# EAGLE design adder subtractor (EAGLE 7.2.0)
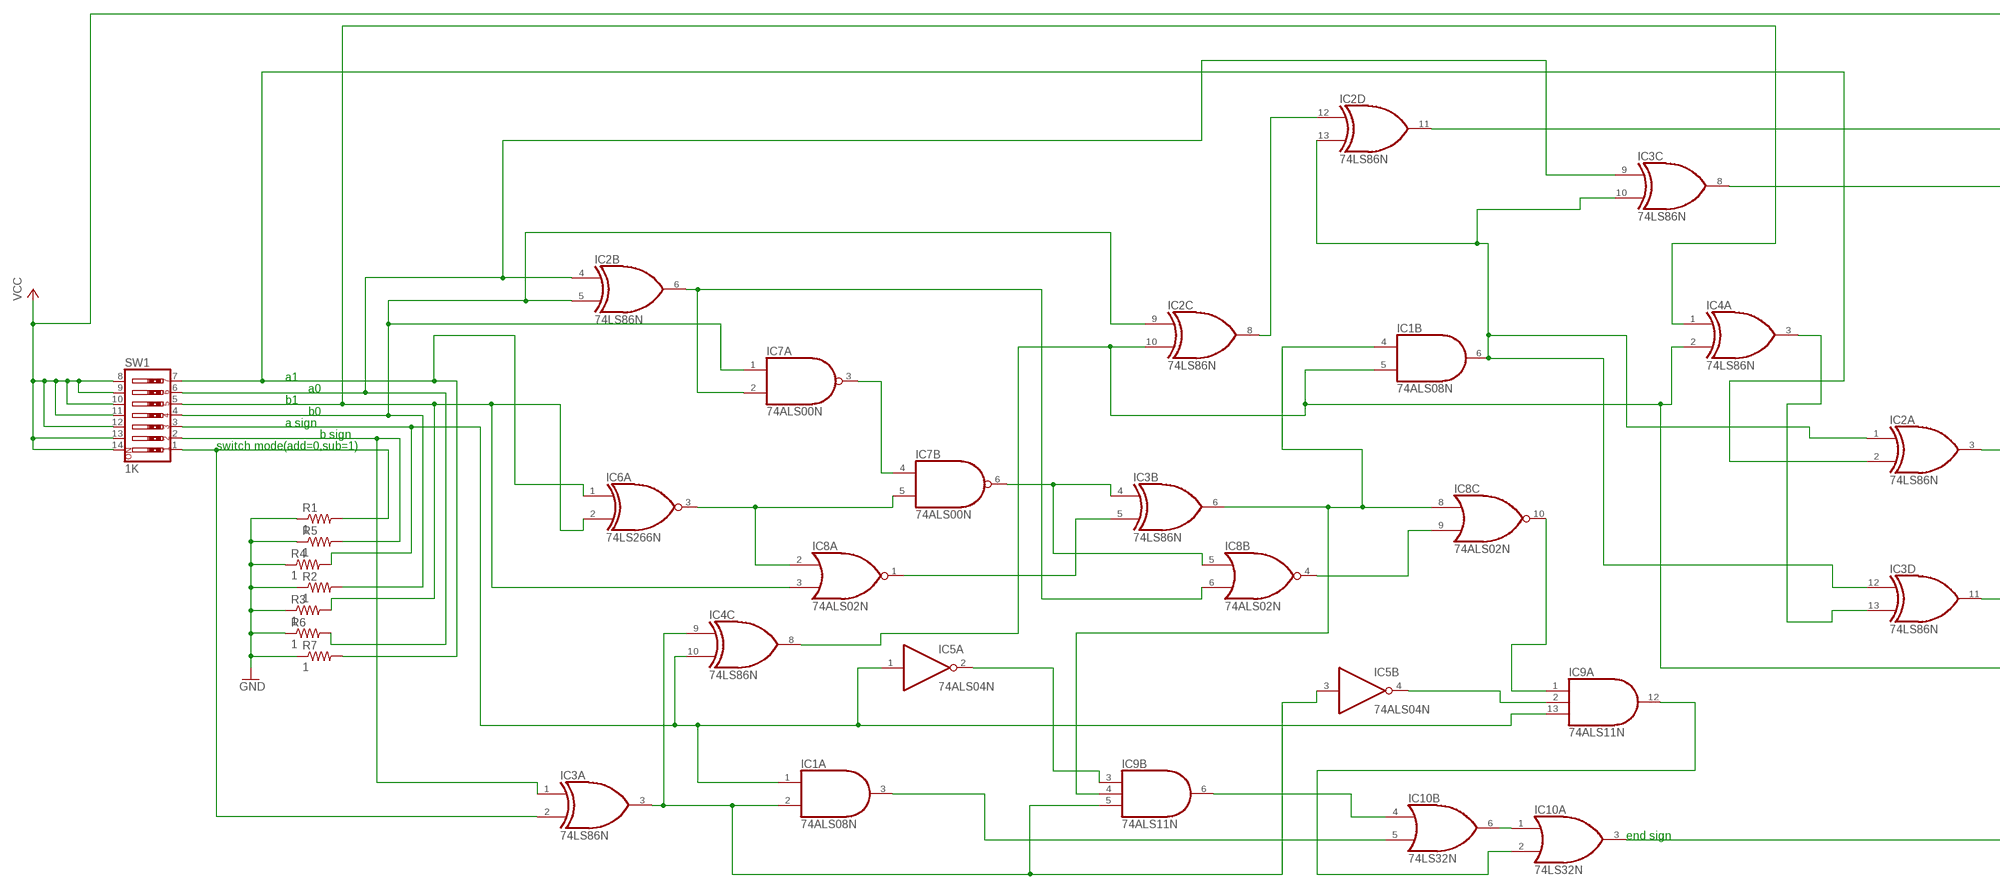
[diagram p0: schematic, sheet 1, part 1 of 2]
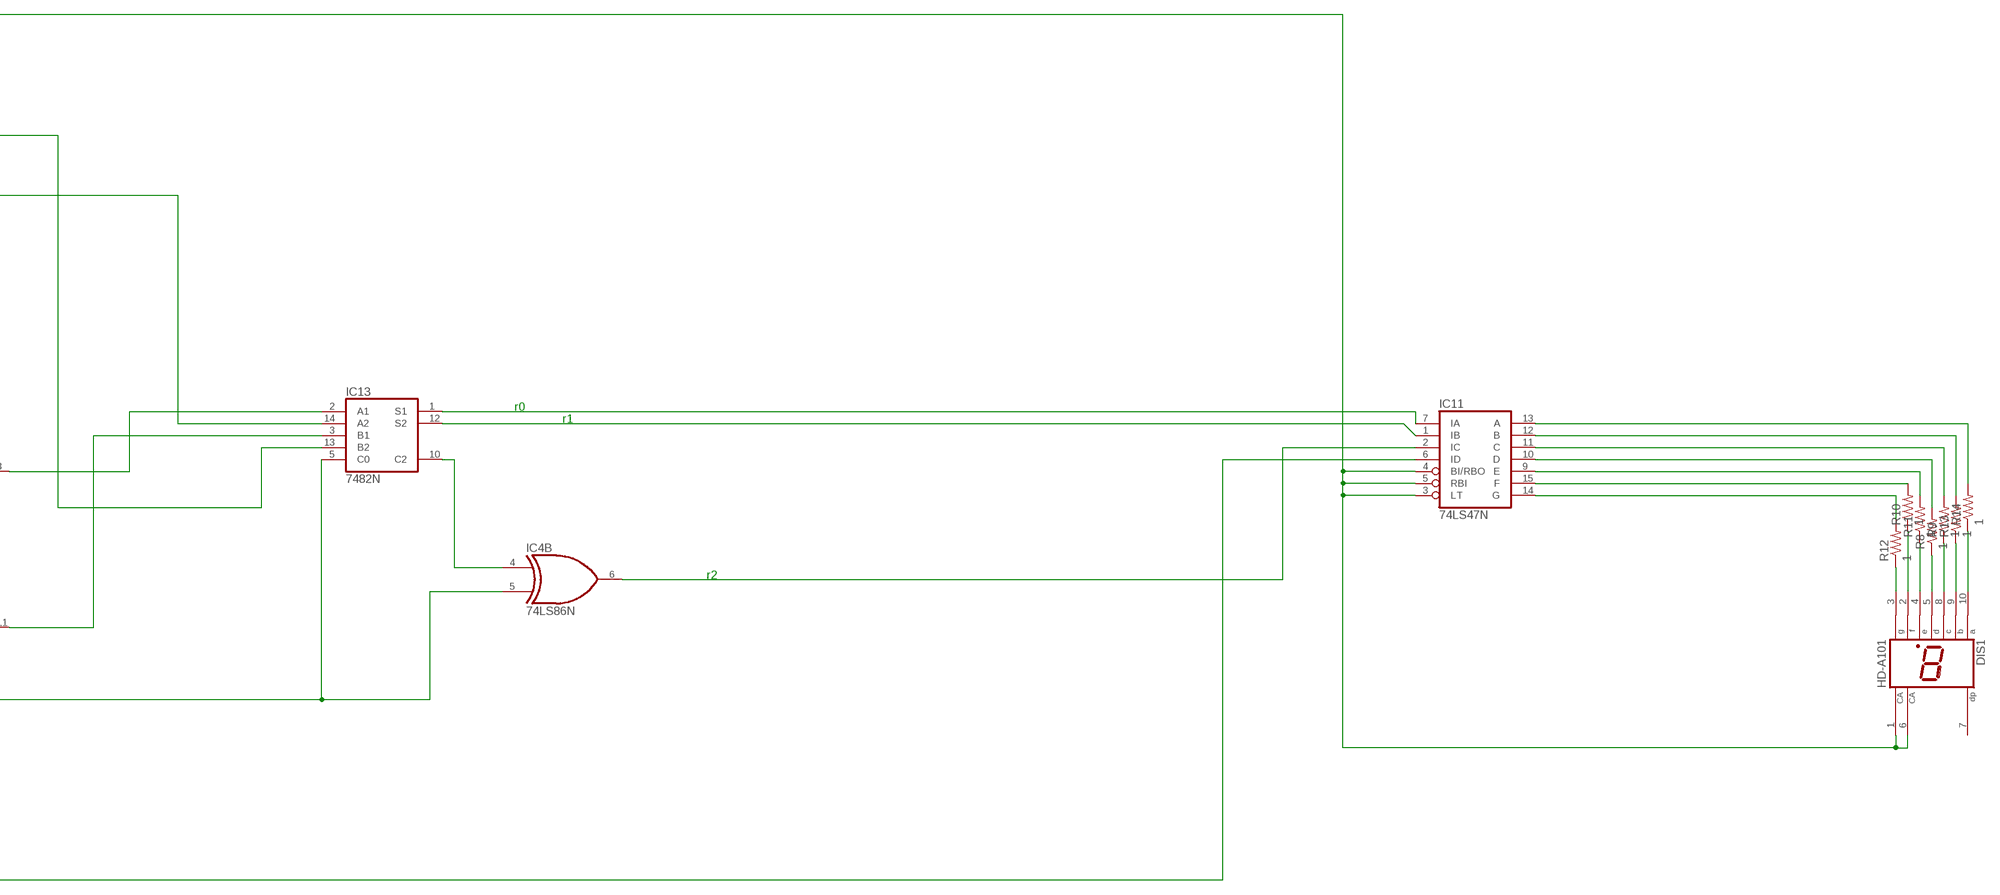
[diagram p1: schematic, sheet 1, part 2 of 2]

## Parts
DIS1  HD-A101  [HDSP-A]
IC1  74ALS08N  [DIL14]
IC2  74LS86N  [DIL14]
IC3  74LS86N  [DIL14]
IC4  74LS86N  [DIL14]
IC5  74ALS04N  [DIL14]
IC6  74LS266N  [DIL14]
IC7  74ALS00N  [DIL14]
IC8  74ALS02N  [DIL14]
IC9  74ALS11N  [DIL14]
IC10  74LS32N  [DIL14]
IC11  74LS47N  [DIL16]
IC13  7482N  [DIL14]
R1  1  R-US_0204/2V  [0204V]
R2  1  R-US_0204/2V  [0204V]
R3  1  R-US_0204/2V  [0204V]
R4  1  R-US_0204/2V  [0204V]
R5  1  R-US_0204/2V  [0204V]
R6  1  R-US_0204/2V  [0204V]
R7  1  R-US_0204/2V  [0204V]
R8  1  R-US_0204/2V  [0204V]
R9  1  R-US_0204/2V  [0204V]
R10  1  R-US_0204/2V  [0204V]
R11  1  R-US_0204/2V  [0204V]
R12  1  R-US_0204/2V  [0204V]
R13  1  R-US_0204/2V  [0204V]
R14  1  R-US_0204/2V  [0204V]
SW1  1K  SW_DIP-7  [EDG-07]

## Nets
GND: R1.1 R2.1 R3.1 R4.1 R5.1 R6.1 R7.1
N$1: IC2.2(A:I1) IC6.1(A:I0) R7.2 SW1.7
N$2: IC2.4(B:I0) IC3.9(C:I0) R6.2 SW1.6
N$3: IC4.1(A:I0) IC6.2(A:I1) IC8.3(A:I1) R3.2 SW1.5
N$4: IC2.5(B:I1) IC2.9(C:I0) IC7.1(A:I0) R2.2 SW1.4
N$5: IC1.1(A:I0) IC4.10(C:I1) IC5.1(A:I) IC9.13(A:I2) R4.2 SW1.3
N$6: IC3.1(A:I0) R5.2 SW1.2
N$7: IC2.11(D:O) IC13.13(B2)
N$9: IC2.6(B:O) IC7.2(A:I1) IC8.6(B:I1)
N$10: IC6.3(A:O) IC7.5(B:I1) IC8.2(A:I0)
N$11: IC7.3(A:O) IC7.4(B:I0)
N$12: IC3.4(B:I0) IC7.6(B:O) IC8.5(B:I0)
N$13: IC3.5(B:I1) IC8.1(A:O)
N$14: IC1.4(B:I0) IC3.6(B:O) IC8.8(C:I0) IC9.4(B:I1)
N$15: IC8.4(B:O) IC8.9(C:I1)
N$16: IC8.10(C:O) IC9.1(A:I0)
N$17: IC1.2(A:I1) IC3.3(A:O) IC4.9(C:I0) IC5.3(B:I) IC9.5(B:I2)
N$18: IC5.4(B:O) IC9.2(A:I1)
N$19: IC5.2(A:O) IC9.3(B:I0)
N$20: IC9.6(B:O) IC10.4(B:I0)
N$21: IC9.12(A:O) IC10.2(A:I1)
N$22: IC1.3(A:O) IC10.5(B:I1)
N$23: IC10.3(A:O) IC11.6(ID)
N$25: IC1.5(B:I1) IC2.10(C:I1) IC4.2(A:I1) IC4.5(B:I1) IC4.8(C:O) IC13.5(C0)
N$26: IC2.8(C:O) IC2.12(D:I0)
N$27: IC1.6(B:O) IC2.1(A:I0) IC2.13(D:I1) IC3.10(C:I1) IC3.12(D:I0)
N$28: IC3.13(D:I1) IC4.3(A:O)
N$29: IC2.3(A:O) IC13.2(A1)
N$30: IC3.8(C:O) IC13.14(A2)
N$31: IC3.11(D:O) IC13.3(B1)
N$33: IC11.7(IA) IC13.1(S1)
N$34: IC11.1(IB) IC13.12(S2)
N$35: IC4.4(B:I0) IC13.10(C2)
N$36: IC4.6(B:O) IC11.2(IC)
N$37: DIS1.10(A) R14.1
N$38: DIS1.9(B) R13.1
N$39: DIS1.8(C) R9.1
N$40: DIS1.5(D) R8.1
N$41: DIS1.4(E) R11.1
N$42: DIS1.2(F) R10.1
N$43: DIS1.3(G) R12.1
N$44: IC11.13(A) R14.2
N$45: IC11.12(B) R13.2
N$46: IC11.11(C) R9.2
N$47: IC11.10(D) R8.2
N$48: IC11.9(E) R11.2
N$49: IC11.15(F) R10.2
N$50: IC11.14(G) R12.2
N$51: IC3.2(A:I1) R1.2 SW1.1
N$55: IC10.1(A:I0) IC10.6(B:O)
VCC: DIS1.1(CA) DIS1.6(CA) IC11.3(LT) IC11.4(BI/RBO) IC11.5(RBI) SW1.8 SW1.9 SW1.10 SW1.11 SW1.12 SW1.13 SW1.14
Unconnected: DIS1.7(DP) IC1.8(C:O) IC1.9(C:I0) IC1.10(C:I1) IC1.11(D:O) IC1.12(D:I0) IC1.13(D:I1) IC4.11(D:O) IC4.12(D:I0) IC4.13(D:I1) IC5.5(C:I) IC5.6(C:O) IC5.8(D:O) IC5.9(D:I) IC5.10(E:O) IC5.11(E:I) IC5.12(F:O) IC5.13(F:I) IC6.4(B:O) IC6.5(B:I0) IC6.6(B:I1) IC6.8(C:I0) IC6.9(C:I1) IC6.10(C:O) IC6.11(D:O) IC6.12(D:I0) IC6.13(D:I1) IC7.8(C:O) IC7.9(C:I0) IC7.10(C:I1) IC7.11(D:O) IC7.12(D:I0) IC7.13(D:I1) IC8.11(D:I0) IC8.12(D:I1) IC8.13(D:O) IC9.8(C:O) IC9.9(C:I0) IC9.10(C:I1) IC9.11(C:I2) IC10.8(C:O) IC10.9(C:I0) IC10.10(C:I1) IC10.11(D:O) IC10.12(D:I0) IC10.13(D:I1)

## Notes on the sheet
- a1
- a0 | r0
- b1 | r1
- b0
- a sign
- b sign
- switch mode(add=0,sub=1)
- r2
- end sign

## Power pins joined to a net without a drawn wire
GND: IC1.7(P:GND) IC2.7(P:GND) IC3.7(P:GND) IC4.7(P:GND) IC5.7(P:GND) IC6.7(P:GND) IC7.7(P:GND) IC8.7(P:GND) IC9.7(P:GND) IC10.7(P:GND) IC11.8(GND) IC13.7(GND)
VCC: IC1.14(P:VCC) IC2.14(P:VCC) IC3.14(P:VCC) IC4.14(P:VCC) IC5.14(P:VCC) IC6.14(P:VCC) IC7.14(P:VCC) IC8.14(P:VCC) IC9.14(P:VCC) IC10.14(P:VCC) IC11.16(VCC) IC13.4(VCC)

## Library data of the parts
DIS1 = display-hp:HD-A101: LED DISPLAY 1-character 7 segment, decimal point right; OC_FARNELL: unknown; OC_NEWARK: unknown
IC1 = 74xx-us:74*08: Quad 2-input AND gate
IC2-IC4 = 74xx-us:74*86: Quad 2-input EXCLUSIV-OR (XOR) gate
IC5 = 74xx-us:74*04: Hex INVERTER
IC6 = 74xx-us:74*266: Quadruple EXCLUSIVE-NOR (XNOR), open-collector
IC7 = 74xx-us:74*00: Quad 2-input NAND gate
IC8 = 74xx-us:74*02: Quad 2-input NOR gate
IC9 = 74xx-us:74*11: Triple 3-input AND gate
IC10 = 74xx-us:74*32: Quad 2-input OR gate
IC11 = 74xx-us:74*47: BCD to seven segment DECODER/DRIVER Source: http://www.ee.washington.edu/stores/DataSheets/74ls/74ls47.pdf
IC13 = 74xx-us:74*82: 2-bit binary full ADDER
R1-R14 = rcl:R-US_: RESISTOR, American symbol
SW1 = special:SW_DIP-7: DIP SWITCH

## Board
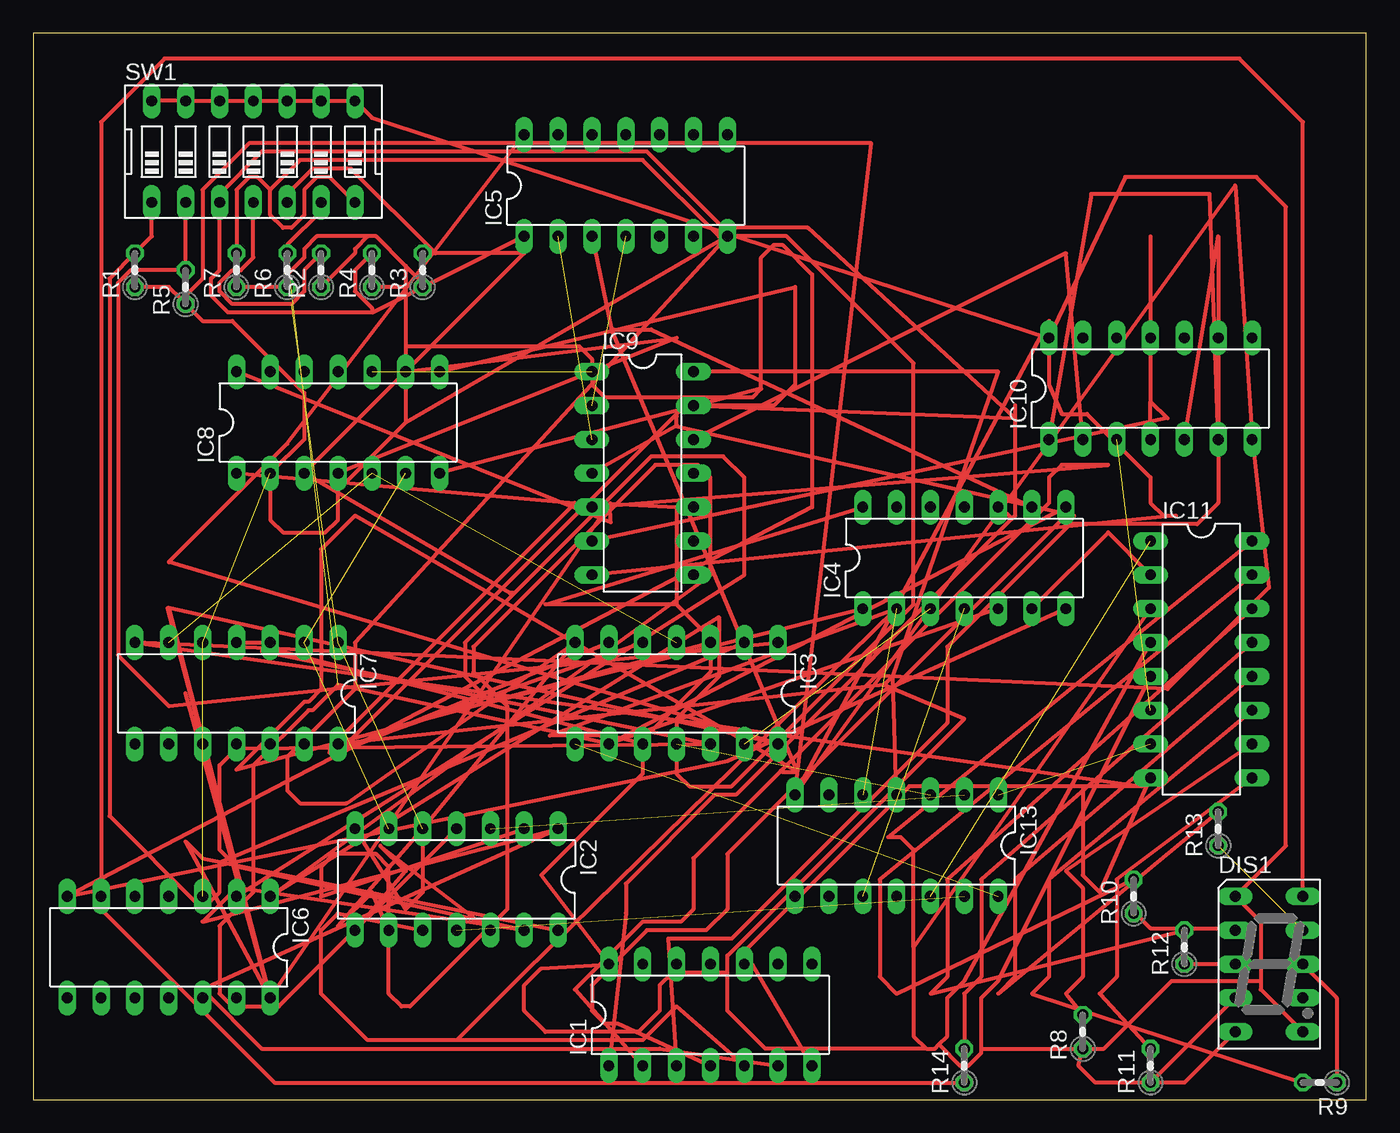
[diagram p2: board, top side]

Size 100 x 80 mm. Coordinates in mm from the lower left corner, seen from the top.
Outline: 0,0 100,0 100,80 0,80 0,0
Copper layers (1*16): Top 0.035mm / dielectric 1.5mm / Bottom 0.035mm
Design rules "default": minimum track width 10mil, minimum drill 24mil, track to track 8mil, track to pad 8mil, pad to pad 8mil, via to via 8mil, smd to smd 8mil, copper to edge 40mil, drill to drill 8mil, minimum pad ring 10mil, minimum via ring 8mil, stop-mask expansion 4mil, vias tented up to drill 0mil, thermal gap 10mil

### Footprints (pad centres in the part's own frame; a part is rotated, then mirrored left to right if it is on the bottom)
HDSP-A = drill 0.813 long: 1 -2.54,5.08; 2 -2.54,2.54; 3 -2.54,0; 4 -2.54,-2.54; 5 -2.54,-5.08; 6 2.54,-5.08; 7 2.54,-2.54; 8 2.54,0; 9 2.54,2.54; 10 2.54,5.08
DIL14 = drill 0.813 long: 1 -7.62,-3.81; 2 -5.08,-3.81; 3 -2.54,-3.81; 4 0,-3.81; 5 2.54,-3.81; 6 5.08,-3.81; 7 7.62,-3.81; 8 7.62,3.81; 9 5.08,3.81; 10 2.54,3.81; 11 0,3.81; 12 -2.54,3.81; 13 -5.08,3.81; 14 -7.62,3.81
DIL16 = drill 0.813 long: 1 -8.89,-3.81; 2 -6.35,-3.81; 3 -3.81,-3.81; 4 -1.27,-3.81; 5 1.27,-3.81; 6 3.81,-3.81; 7 6.35,-3.81; 8 8.89,-3.81; 9 8.89,3.81; 10 6.35,3.81; 11 3.81,3.81; 12 1.27,3.81; 13 -1.27,3.81; 14 -3.81,3.81; 15 -6.35,3.81; 16 -8.89,3.81
0204V = drill 0.813 octagon: 1 -1.27,0; 2 1.27,0
EDG-07 = drill 0.813 long: 1 -7.62,-3.81; 2 -5.08,-3.81; 3 -2.54,-3.81; 4 0,-3.81; 5 2.54,-3.81; 6 5.08,-3.81; 7 7.62,-3.81; 8 7.62,3.81; 9 5.08,3.81; 10 2.54,3.81; 11 0,3.81; 12 -2.54,3.81; 13 -5.08,3.81; 14 -7.62,3.81

### Placement (x,y rotation side)
DIS1  92.71,10.16 0 top
IC1  50.8,6.35 0 top
IC2  31.75,16.51 180 top
IC3  48.26,30.48 180 top
IC4  69.85,40.64 0 top
IC5  44.45,68.58 0 top
IC6  10.16,11.43 180 top
IC7  15.24,30.48 180 top
IC8  22.86,50.8 0 top
IC9  45.72,46.99 270 top
IC10  83.82,53.34 0 top
IC11  87.63,33.02 270 top
IC13  64.77,19.05 180 top
R1  7.62,62.23 90 top
R2  21.59,62.23 90 top
R3  29.21,62.23 90 top
R4  25.4,62.23 90 top
R5  11.43,60.96 90 top
R6  19.05,62.23 90 top
R7  15.24,62.23 90 top
R8  78.74,5.08 90 top
R9  96.52,1.27 180 top
R10  82.55,15.24 90 top
R11  83.82,2.54 90 top
R12  86.36,11.43 90 top
R13  88.9,20.32 90 top
R14  69.85,2.54 90 top
SW1  16.51,71.12 0 top

### Tracks (layer width: path | path; a pad name or v marks a point on that pad's centre or on a via)
GND
  Top 0.305: IC4.7 52.07,25.4 IC6.7 58.42,44.45 58.42,61.91 56.2,64.14 55.56,64.14 54.61,63.18 54.61,53.34 | IC2.7 27.94,14.29 29.21,15.56 29.21,20.32 IC3.7 23.5,22.23 20,22.23 19.05,23.18 19.05,25.72 24.13,30.8 24.13,34.29 IC5.7 27.94,50.8 | R7.1 R6.1 19.05,61.91 20.32,63.18 20.32,63.82 21.27,64.77 25.08,64.77 | R2.1 24.13,63.5 24.13,63.82 25.08,64.77 | 25.08,64.77 25.72,64.77 27.94,62.55 | 27.94,62.55 29.21,61.28 R3.1 | 27.94,62.55 27.94,60.96 | 27.94,60.96 27.94,56.52 | 27.94,56.52 27.94,50.8 | 54.61,53.34 53.98,52.7 42.86,52.7 41.91,53.66 41.91,55.56 40.96,56.52 27.94,56.52 | 54.61,53.34 IC8.7 | 27.94,60.96 R4.1 | IC1.7 53.34,11.11 65.72,23.5 78.74,23.5 | 78.74,23.5 83.19,23.5 IC7.7 85.09,30.8 92.71,38.42 IC10.7 90.17,68.58 IC13.7 | IC11.8 80.01,15.56 78.74,16.83 78.74,23.5 | R1.1 10.16,60.96 11.11,60.01 | IC9.7 85.72,43.81 84.77,43.81 83.82,44.77 83.82,46.67 79.06,51.44 77.15,51.44 76.2,53.66 76.2,58.42 IC13.7 | 11.11,60.01 12.7,61.59 12.7,68.26 16.19,71.75 62.87,71.75 IC13.7 | 11.11,60.01 R5.1 12.7,58.42 14.92,58.42 20.32,53.02 20.32,49.53 17.78,46.99 17.78,43.5 18.73,42.55 21.91,42.55 22.86,43.5 22.86,45.72 27.94,50.8
N$1
  Top 0.305: R7.2 15.24,68.26 16.19,69.22 16.83,69.22 17.78,68.26 | 17.78,68.26 17.78,66.36 18.73,65.41 19.37,65.41 20.32,66.36 20.32,68.26 21.27,69.22 22.23,69.22 SW1.7 | IC2.2 21.59,15.24 21.59,17.46 22.54,18.41 25.72,18.41 26.67,17.46 26.67,7.94 27.62,6.99 28.26,6.99 35.56,14.29 35.56,29.53 33.02,32.07 33.02,33.97 46.67,47.62 49.85,47.62 50.8,46.67 50.8,39.37 IC6.1 51.44,36.2 51.44,31.75 48.26,28.57 48.26,24.45 49.21,23.5 52.39,23.5 66.04,37.15 66.04,55.24 56.52,64.77 51.44,64.77 45.72,70.48 20,70.48 17.78,68.26
N$2  (1 unrouted)
  Top 0.305: R6.2 19.05,64.14 21.59,66.67 SW1.6 | IC2.4 18.41,6.99 14.92,6.99 13.97,7.94 13.97,13.02 16.51,15.56 16.51,25.08 20.64,29.21 20.95,29.21 22.86,31.11 IC3.9
N$3
  Top 0.305: IC4.1 34.29,29.84 32.38,31.75 32.38,34.29 36.07,37.97 | 36.07,37.97 46.35,48.26 51.75,48.26 53.34,46.67 53.34,39.37 IC6.2 | 30.16,63.5 36.83,63.5 IC8.3 35.76,38 36.04,38 36.07,37.97 | 30.16,63.5 R3.2 | SW1.5 19.05,67.94 20.95,69.85 23.81,69.85 30.16,63.5
N$4  (2 unrouted)
  Top 0.305: IC2.5 22.86,13.02 25.4,15.56 IC2.9 | SW1.4 16.51,63.18 15.56,62.23 14.92,62.23 13.97,61.28 13.97,60.64 14.92,59.69 19.37,59.69 20.32,60.64 20.32,62.23 R2.2
N$5
  Top 0.305: 25.4,59.05 25.4,59.37 24.13,60.64 24.13,62.23 R4.2 | 25.4,59.05 IC5.1 | 25.4,59.05 14.61,59.05 13.34,60.33 13.34,61.59 13.97,62.23 SW1.3 13.97,67.94 17.14,71.12 46.04,71.12 51.75,65.41 58.1,65.41 73.66,51.12 | IC1.1 44.45,13.97 44.45,16.19 51.12,22.86 52.7,22.86 73.42,43.58 | 73.42,43.58 73.66,43.81 73.66,51.12 | 73.66,52.07 73.66,51.12 | IC9.13 73.66,51.12 | IC4.10 72.55,44.45 73.42,43.58
N$6
  Top 0.305: IC3.1 10.16,29.53 6.35,33.34 6.35,61.28 7.3,62.23 R5.2 SW1.2
N$7  (1 unrouted)
N$9  (2 unrouted)
N$10  (2 unrouted)
N$11
  Top 0.305: IC7.4 IC7.3
N$12  (2 unrouted)
N$13
  Top 0.305: IC3.5 22.23,26.04 22.23,26.35 40.64,44.77 IC8.1
N$14
  Top 0.305: IC1.4 43.81,5.71 42.86,5.71 41.91,6.67 41.91,8.57 46.04,12.7 50.48,12.7 52.07,14.29 52.07,18.41 77.47,43.81 78.11,43.81 48.23,50.52 | IC9.4 48.23,50.52 | IC3.6 22.86,26.04 48.18,51.36 | 48.18,51.36 48.9,52.07 55.56,52.07 57.15,53.66 57.15,60.96 IC8.8 | 48.18,51.36 48.26,51.28 48.26,50.64 48.23,50.52
N$15
  Top 0.305: IC8.4 48.26,57.15 IC8.9
N$16  (1 unrouted)
N$17
  Top 0.305: IC1.2 40.64,8.26 45.72,13.34 48.58,13.34 49.53,14.29 49.53,18.1 56.09,24.66 | 56.09,24.66 76.2,44.77 76.2,46.67 77.15,47.62 80.64,47.62 IC9.5 | IC3.3 15.24,24.77 20.32,29.84 20.64,29.84 21.59,30.8 21.59,41.27 24.13,43.81 57.3,24.64 | IC5.3 43.39,57.74 | 43.39,57.74 57.3,24.64 | 57.3,24.64 57.28,24.59 56.16,24.59 56.09,24.66 | IC4.9 46.35,57.78 43.5,57.78 43.39,57.74
N$18  (1 unrouted)
N$19  (1 unrouted)
N$20
  Top 0.305: IC9.6 85.09,51.12 83.82,52.39 | 83.82,64.77 83.82,52.39 | IC10.4 83.82,52.39
N$21
  Top 0.305: IC9.12 77.47,63.5 IC10.2
N$22
  Top 0.305: IC1.3 47.62,12.06 52.39,12.06 68.58,28.26 68.58,33.97 77.79,43.18 87.31,43.18 88.9,44.77 88.9,64.77 IC10.5
N$23  (1 unrouted)
N$25  (1 unrouted)
  Top 0.305: IC4.5 43.18,26.67 | 43.18,26.67 42.55,27.3 38.73,27.3 IC4.2 36.83,9.53 31.75,4.45 | 43.18,26.67 IC4.8 | IC2.10 22.86,13.97 21.59,12.7 21.59,7.94 25.08,4.45 31.75,4.45 | 31.75,4.45 45.72,4.45 48.26,6.99 IC1.5
N$26
  Top 0.305: IC2.12 26.04,19.05 27.94,17.14 IC2.8
N$27
  Top 0.305: IC3.10 18.41,33.66 17.14,33.66 IC3.12 15.24,26.35 13.97,25.08 13.97,18.73 15.24,17.46 IC2.13 15.24,15.88 12.7,13.34 IC2.1 12.7,8.26 17.14,3.81 46.99,3.81 IC1.6
N$28  (1 unrouted)
N$29  (1 unrouted)
N$30  (1 unrouted)
N$31  (1 unrouted)
N$33  (1 unrouted)
N$34  (1 unrouted)
N$35  (1 unrouted)
N$36
  Top 0.305: IC4.6 80.64,42.55 IC11.2
N$37
  Top 0.305: R14.1 18.1,1.27 5.08,14.29 5.08,73.34 9.84,78.11 90.49,78.11 95.25,73.34 DIS1.10
N$38  (1 unrouted)
N$39
  Top 0.305: R9.1 97.79,7.62 DIS1.8
N$40
  Top 0.305: R8.1 78.42,2.54 79.69,1.27 86.36,1.27 DIS1.5
N$41
  Top 0.305: DIS1.4 R11.1
N$42
  Top 0.305: DIS1.2 89.97,12.85 83.82,12.85 82.7,13.97 R10.1
N$43
  Top 0.305: DIS1.3 R12.1
N$44
  Top 0.305: R14.2 69.85,7.94 71.12,9.21 71.12,16.51 IC11.13
N$45
  Top 0.305: R13.2 72.39,7.94 73.66,9.21 73.66,16.51 IC11.12
N$46
  Top 0.305: R9.2 74.93,7.94 76.2,9.21 76.2,16.51 IC11.11
N$47
  Top 0.305: R8.2 77.47,7.94 78.74,9.21 78.74,15.88 77.47,17.14 IC11.10
N$48
  Top 0.305: R11.2 80.01,7.94 81.28,9.21 81.28,16.51 IC11.9
N$49
  Top 0.305: R10.2 64.77,7.94 63.5,9.21 63.5,16.51 IC11.15
N$50
  Top 0.305: R12.2 67.31,7.94 68.58,9.21 68.58,16.51 IC11.14
N$51
  Top 0.305: IC3.2 13.97,17.78 13.97,15.56 13.02,14.61 12.38,14.61 5.71,21.27 5.71,61.59 R1.2 8.89,64.77 SW1.1
N$55
  Top 0.305: IC10.1 79.38,67.94 88.27,67.94 IC10.6
VCC
  Top 0.305: IC2.14 12.7,18.1 11.43,19.37 IC6.14 | 10.15,36.9 IC3.14 10.16,40.32 19.05,49.21 IC5.14 | 10.15,36.9 IC6.14 | IC6.14 11.43,30.48 | SW1.14 SW1.13 SW1.12 SW1.11 SW1.10 SW1.9 SW1.8 25.4,73.66 IC10.14 81.92,69.22 91.76,69.22 93.98,66.99 93.98,19.05 DIS1.1 92.08,13.34 92.08,8.89 | 48.26,37.15 50.8,34.61 50.8,32.07 45.72,26.99 45.72,24.45 38.1,16.83 IC1.14 38.1,9.84 36.83,8.57 36.83,6.67 38.42,5.08 45.4,5.08 46.99,6.67 46.99,8.57 47.94,9.53 52.07,9.53 | 48.26,37.15 48.26,44.45 43.28,44.72 | IC6.14 43.28,44.72 | IC4.14 38.42,37.15 48.26,37.15 | DIS1.6 92.08,8.26 92.08,8.89 | IC11.16 64.14,19.68 65.09,19.68 66.04,18.73 66.04,11.43 | IC11.3 66.04,11.43 | IC11.4 69.85,8.89 68.58,7.62 68.58,4.76 67.94,4.13 | 67.94,4.13 67.63,3.81 66.99,3.81 | 66.99,3.81 66.04,4.76 66.04,11.43 | 63.81,31.09 69.85,28.57 52.07,10.79 52.07,9.53 | 63.81,31.09 IC7.14 | 52.07,9.53 52.07,6.67 54.93,3.81 66.99,3.81 | IC11.5 72.39,8.89 71.12,7.62 71.12,3.81 | 71.12,3.81 71.12,3.49 70.17,2.54 69.53,2.54 67.94,4.13 | 92.08,8.89 85.41,8.89 80.33,3.81 71.12,3.81 | IC9.14 72.39,54.61 64.5,31.73 | IC13.4 64.5,31.73 | IC8.14 43.31,43.31 43.28,44.72 | IC6.14 10.06,36.88 10.15,36.9 | 64.5,31.73 64.45,31.75 63.82,31.11 63.81,31.09